# Altium schematic sheet LVBATTIND-MCU.SchDoc
size A4; SheetNumber: 3; SheetTotal: 3
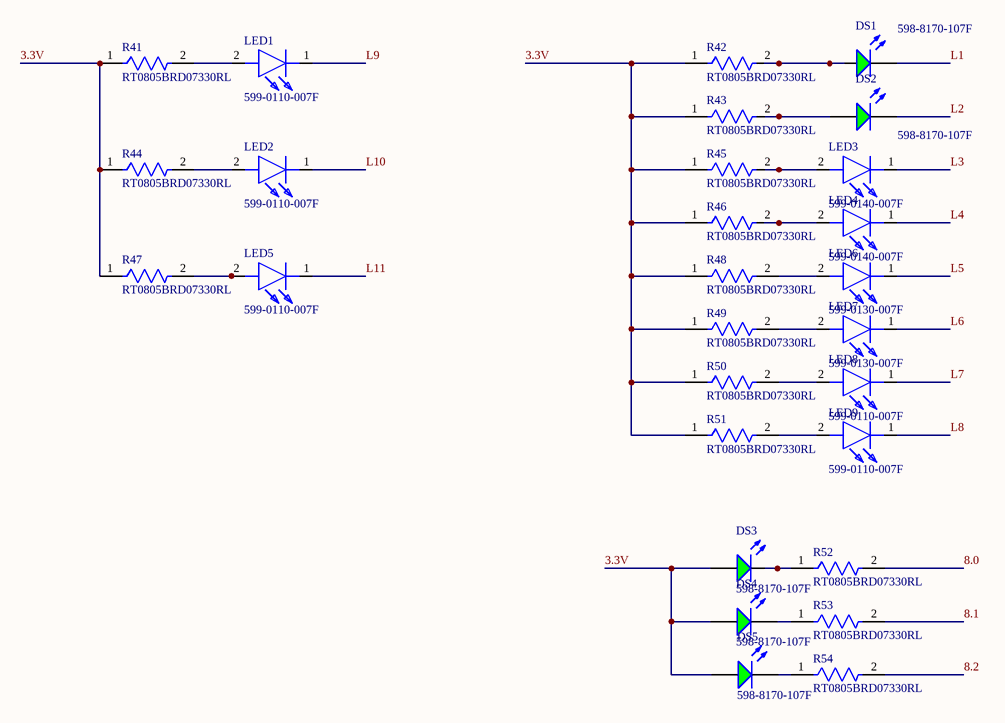
[diagram p0: LVBATTIND-MCU.SchDoc]

## Parts
DS1  598-8170-107F  [DIAL-0805-2_V]
DS2  598-8170-107F  [DIAL-0805-2_V]
DS3  598-8170-107F  [DIAL-0805-2_V]
DS4  598-8170-107F  [DIAL-0805-2_V]
DS5  598-8170-107F  [DIAL-0805-2_V]
LED1  599-0110-007F  [LEDM2012X90N]
LED2  599-0110-007F  [LEDM2012X90N]
LED3  599-0140-007F  [LEDC2012X70N]
LED4  599-0140-007F  [LEDC2012X70N]
LED5  599-0110-007F  [LEDM2012X90N]
LED6  599-0130-007F  [5990130007F]
LED7  599-0130-007F  [5990130007F]
LED8  599-0110-007F  [LEDM2012X90N]
LED9  599-0110-007F  [LEDM2012X90N]
R41  RT0805BRD07330RL  [FP-RT0805-MFG]
R42  RT0805BRD07330RL  [FP-RT0805-MFG]
R43  RT0805BRD07330RL  [FP-RT0805-MFG]
R44  RT0805BRD07330RL  [FP-RT0805-MFG]
R45  RT0805BRD07330RL  [FP-RT0805-MFG]
R46  RT0805BRD07330RL  [FP-RT0805-MFG]
R47  RT0805BRD07330RL  [FP-RT0805-MFG]
R48  RT0805BRD07330RL  [FP-RT0805-MFG]
R49  RT0805BRD07330RL  [FP-RT0805-MFG]
R50  RT0805BRD07330RL  [FP-RT0805-MFG]
R51  RT0805BRD07330RL  [FP-RT0805-MFG]
R52  RT0805BRD07330RL  [FP-RT0805-MFG]
R53  RT0805BRD07330RL  [FP-RT0805-MFG]
R54  RT0805BRD07330RL  [FP-RT0805-MFG]

## Nets
3.3V: DS3.1(A) DS4.1(A) DS5.1(A) R41.1 R42.1 R43.1 R44.1 R45.1 R46.1 R47.1 R48.1 R49.1 R50.1 R51.1
8.0: R52.2
8.1: R53.2
8.2: R54.2
L1: DS1.2(K)
L2: DS2.2(K)
L3: LED3.1(K)
L4: LED4.1(K)
L5: LED6.1(K)
L6: LED7.1(K)
L7: LED8.1(K)
L8: LED9.1(K)
L9: LED1.1(K)
L10: LED2.1(K)
L11: LED5.1(K)
NetDS1_1: DS1.1(A) R42.2
NetDS2_1: DS2.1(A) R43.2
NetDS3_2: DS3.2(K) R52.1
NetDS4_2: DS4.2(K) R53.1
NetDS5_2: DS5.2(K) R54.1
NetLED1_2: LED1.2(A) R41.2
NetLED2_2: LED2.2(A) R44.2
NetLED3_2: LED3.2(A) R45.2
NetLED4_2: LED4.2(A) R46.2
NetLED5_2: LED5.2(A) R47.2
NetLED6_2: LED6.2(A) R48.2
NetLED7_2: LED7.2(A) R49.2
NetLED8_2: LED8.2(A) R50.2
NetLED9_2: LED9.2(A) R51.2

## Library data of the parts
DS1-DS5 = CMP-2000-05655-1: Single Color, 2 V, -30 to 85 degC, 2-Pin SMD (0805), RoHS, Tape and Reel; Main Category: ChipLED; Shape Type: Rectangular; Forward Current: 25mA; Product Length (mm): 2mm; Emitting Color: YellowGreen; Test Current (It): 20mA; Number of  Elements: 1; Luminous Intensity: 20mcd; DELETED: Compliant; Reverse Voltage: 5V; Chip Material: GaP; High Brightness: No; Viewing Angle: 140deg; Dominant Wave Length: 570nm; Type: Uni-Color; Product Depth (mm): 1.25mm; Power Dissipation: 60W; Product Height (mm): 0.7mm; Forward Voltage: 2.4V; Lens Dimensions: 1.4x1.25x0.4mm; Pin Count: 2; Datasheet URL: https://datasheet.ciiva.com/22748/1484480-22748121.pdf; Operating Temperature Classification: Commercial; Package Reference: 0805; Operating Temp Range: -30Cto85C; Mounting: SurfaceMount; Mounting Technology: SurfaceMount; Manufacturer URL: http://www.dialight.com/; Package Description: 2-Pin Surface Mount Device, Body 2 x 1.25 mm; Lum Intensity: 20mcd; Datasheet Version: 10/2008; Rad Hardened: No; Packaging: TapeandReel; Package Type: SMD
LED1 LED2 LED5 LED8 LED9 = 599-0110-007F: LED; Datasheet Link: https://www.mouser.com/datasheet/2/109/Dialight_CBI_data_599-0805_Apr2018-1370606.pdf; Height: 0.9mm; Manufacturer_Part_Number: 599-0110-007F; Mouser Part Number: 645-599-0110-007F; Mouser Price/Stock: https://www.mouser.co.uk/ProductDetail/Dialight/599-0110-007F?qs=gTYE2QTfZfS0HtheKY0LlQ%3D%3D; Arrow Part Number: 599-0110-007F; Arrow Price/Stock: https://www.arrow.com/en/products/5990110007f/dialight?region=nac
LED3 LED4 = 599-0140-007F: LED; Datasheet Link: https://mouser.componentsearchengine.com/Datasheets/1/599-0140-007F.pdf; Height: 0.7mm; Manufacturer_Part_Number: 599-0140-007F; Mouser Part Number: 645-599-0140-007F; Mouser Price/Stock: https://www.mouser.co.uk/ProductDetail/Dialight/599-0140-007F?qs=gTYE2QTfZfQrZszkvWmdFA%3D%3D
LED6 LED7 = 599-0130-007F: LED; Datasheet Link: https://www.mouser.ph/ProductDetail/Dialight/599-0130-007F?qs=gTYE2QTfZfQ2TDvykpqMHg%3D%3D&srsltid=AfmBOopk_RwZ8_3NQIYxrCGD4Ay-vQtdR2nUkX0PlPQDcgQe6IiQvy-r; Height: 0.9mm; Manufacturer_Part_Number: 599-0130-007F; Mouser Part Number: 645-599-0130-007F; Mouser Price/Stock: https://www.mouser.co.uk/ProductDetail/Dialight/599-0130-007F?qs=gTYE2QTfZfQ2TDvykpqMHg%3D%3D
R41-R54 = CMP-2001-01631-2: RES 330 OHM 1/8W .1% SMD 0805; Description: RT0805 330Ω 0.125W 25 ppm/°C 0.25%; Resistance: 330Ω; Temperature Coefficient: 25 ppm/°C; Value: 330Ω; Voltage Rating: 150V; Tolerance: 0.0025; Power Rating: 0.125W; Device Class L3: Chip SMD Resistors; Footprint Url: http://www.yageo.com/exep/pages/download/literatures/PYu-R_Mount_10.pdf; Device Class L2: Resistors; Series: RT; ComponentLink2Description: Datasheet; Automotive: No; Mouser Description: Thin Film Resistors - SMD 1/8W 330 ohm .1% 25ppm; Device Class L1: Passive Components; Digikey Description: RES 330 OHM 1/8W .1% SMD 0805; Ipc Land Pattern Name: RESC200125X50; Composition: Thin Film; Height: 0.6mm; RoHS: TRUE; Temperature: -55°C to +155°C; Category: Res; Package: RT0805; Octopart: https://octopart.com/rt0805brd07330rl-yageo-1374790; Temperature Range High: +155°C; ComponentLink2URL: http://www.yageo.com/documents/recent/PYu-RT_1-to-0.01_RoHS_L_9.pdf; Lead Free: Yes; Temperature Range Low: -55°C